# EAGLE schematic bitsyled-v1 (EAGLE 8.3.2)
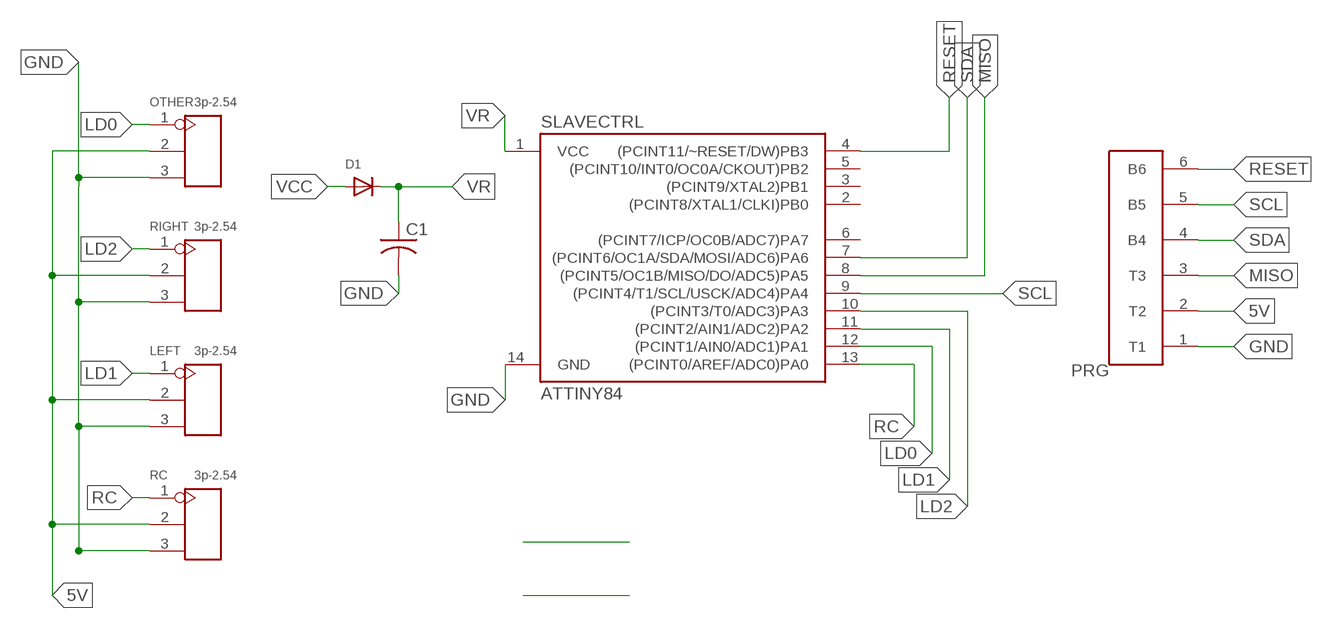
[diagram p0: schematic, sheet 1]

## Parts
C1  C-USC0805  [C0805]
D1  DIODESOD-123  [SOD-123]
LEFT  3p-2.54  DIP-BLACK-MALE-HEADER-VERT(3P-2.54)  [H3-2.54]
OTHER  3p-2.54  DIP-BLACK-MALE-HEADER-VERT(3P-2.54)  [H3-2.54]
PRG  SMDPAD_TB_3X3  [SMDPAD_TB_3X3]
RC  3p-2.54  DIP-BLACK-MALE-HEADER-VERT(3P-2.54)  [H3-2.54]
RIGHT  3p-2.54  DIP-BLACK-MALE-HEADER-VERT(3P-2.54)  [H3-2.54]
SLAVECTRL  ATTINY84  [SO14]

## Nets
5V: LEFT.2 OTHER.2 PRG.2(T2) RC.2 RIGHT.2
GND: C1.2 LEFT.3 OTHER.3 PRG.1(T1) RC.3 RIGHT.3 SLAVECTRL.14(GND)
LD0: OTHER.1 SLAVECTRL.12((PCINT1/AIN0/ADC1)PA1)
LD1: LEFT.1 SLAVECTRL.11((PCINT2/AIN1/ADC2)PA2)
LD2: RIGHT.1 SLAVECTRL.10((PCINT3/T0/ADC3)PA3)
MISO: PRG.3(T3) SLAVECTRL.8((PCINT5/OC1B/MISO/DO/ADC5)PA5)
RC: RC.1 SLAVECTRL.13((PCINT0/AREF/ADC0)PA0)
RESET: PRG.6(B6) SLAVECTRL.4((PCINT11/~RESET/DW)PB3)
SCL: PRG.5(B5) SLAVECTRL.9((PCINT4/T1/SCL/USCK/ADC4)PA4)
SDA: PRG.4(B4) SLAVECTRL.7((PCINT6/OC1A/SDA/MOSI/ADC6)PA6)
VCC: D1.A
VR: C1.1 SLAVECTRL.1(VCC)
Unconnected: D1.C SLAVECTRL.2((PCINT8/XTAL1/CLKI)PB0) SLAVECTRL.3((PCINT9/XTAL2)PB1) SLAVECTRL.5((PCINT10/INT0/OC0A/CKOUT)PB2) SLAVECTRL.6((PCINT7/ICP/OC0B/ADC7)PA7)

## Library data of the parts
C1 = adafruit:C-US: CAPACITOR, American symbol
D1 = adafruit:DIODE: Diode SMADIODE - SMA Surface Mount Package 20V 1A Schottky Diode Digikey: 641-1014-6-ND DO-1N4148 - Through Hole Small Current Diode SOD-123 20V 1 A (.5mV Vf) Schottky Diode - Digikey: MBRX120TPMSCT-ND SOD-323 10V 570mA (.38mV Vf, 3ns) Schottky Diode - Digikey: ZLLS410CT-ND SOD-523 30V 30mA Schottky Diode (RB751S-40TE61) - Digikey: RB751S-40TE61CT-ND SOT23-R/W - SOT23 Package (R = Solder Paste/Reflow Ovens, W = Hand-Soldering) BAT54Film 40V 300mA - Digikey: 497-7162-1-ND
LEFT OTHER RC RIGHT = Seeed-Connector:DIP-BLACK-MALE-HEADER-VERT(3P-2.54): 320020079
PRG = FPVTools:SMDPAD_TB_3X3
SLAVECTRL = SparkFun-IC-Microcontroller:ATTINY84: Atmel 14-pin 2/4/8kB flash uC Datasheet <https://cdn.sparkfun.com/datasheets/Widgets/doc8006.pdf> SparkFun Products Tiny AVR Programmer <https://www.sparkfun.com/products/11801> (PGM-11801) SparkFun Servo Trigger - Continuous Rotation <https://www.sparkfun.com/products/13872> (WIG-13872) SparkFun Servo Trigger <https://www.sparkfun.com/products/13118> (WIG-13118); PROD_ID: IC-11285

## Net classes
0 default: width 0.203 mm, drill 0.203 mm, clearance 0.254 mm